# Altium schematic sheet FPGA_165A_Watchdog.SchDoc: LiveDesign Evaluation - Watchdog
size B; Organization: Altium Limited; Address1: L3, 12a Rodborough Rd; Address2: Frenchs Forest; Address3: NSW; Address4: Australia 2086; DocumentNumber: 1; SheetNumber: 1; SheetTotal: 1
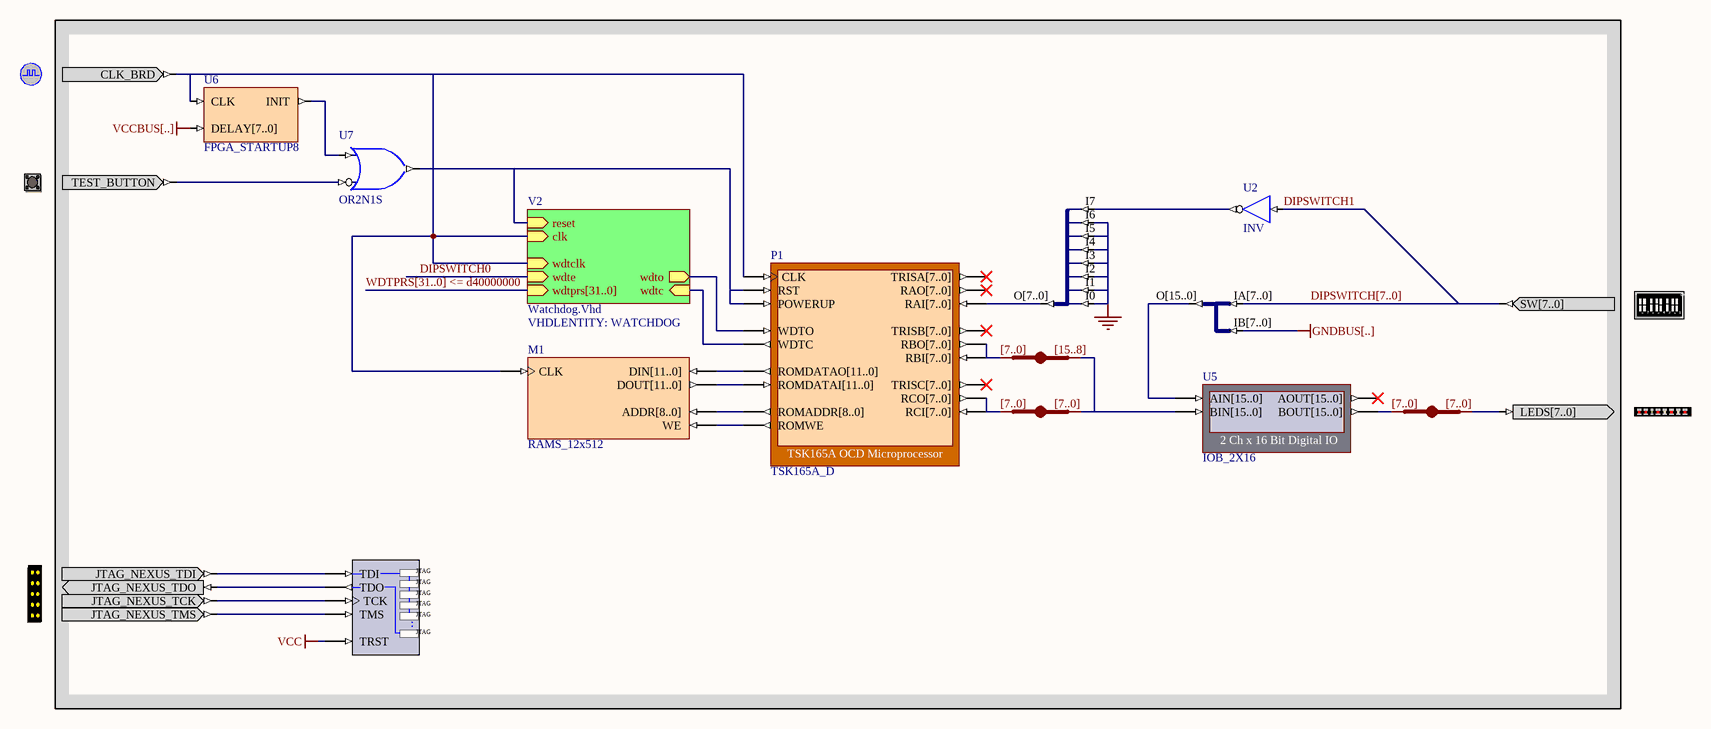
[diagram p0: FPGA_165A_Watchdog.SchDoc]

## Parts
CLOCK_BOARD  CLOCK_BOARD  (value not drawn)
DIPSWITCH  DIPSWITCH  (value not drawn)
JB_AUTO1  IndexA: [7..0]  IndexB: [15..8]  (hidden comment: JB)
JB_AUTO2  IndexA: [7..0]  (hidden comment: JB)
JB_AUTO3  IndexA: [7..0]  (hidden comment: JB)
LED  LED  (value not drawn)
M1  RAMS_12x512
NEXUS_JTAG_CONNECTOR  NEXUS_JTAG_CONNECTOR  (value not drawn)
NEXUS_JTAG_PORT  NEXUS_JTAG_PORT  (value not drawn)
P1  TSK165A_D
TEST_BUTTON  TEST_BUTTON  (value not drawn)
U2  INV
U3  J8S_8B  (value not drawn)
U4  J8B2_16B  (value not drawn)
U5  IOB_2X16
U6  FPGA_STARTUP8
U7  OR2N1S

## Sub-sheets
V2 = Watchdog.Vhd: clk (in), reset (in), wdtc (in), wdtclk (in), wdte (in), wdto (out), wdtprs[31..0] (in)  | VHDLENTITY: WATCHDOG

## Nets
GND: U3.I0 U3.I1 U3.I2 U3.I3 U3.I4 U3.I5 U3.I6
GNDBUS[..]: U4.IB[7..0]
VCC: NEXUS_JTAG_PORT.TRST
VCCBUS[..]: U6.DELAY[7..0]
DIPSWITCH0: sheet V2/wdte
DIPSWITCH1: U2.I
DIPSWITCH[7..0]: DIPSWITCH.SW[7..0] U4.IA[7..0]
NetCLOCK_BOARD_CLK_BRD: CLOCK_BOARD.CLK_BRD M1.CLK P1.CLK U6.CLK ; sheet V2/clk, sheet V2/wdtclk
NetJB_AUTO1_A[0..0]: JB_AUTO1.A[0..0] P1.RBI[7..0] P1.RBO[7..0]
NetJB_AUTO1_B[0..0]: JB_AUTO1.B[0..0] JB_AUTO3.B[0..0] U5.BIN[15..0]
NetJB_AUTO2_A[0..0]: JB_AUTO2.A[0..0] U5.BOUT[15..0]
NetJB_AUTO2_B[0..0]: JB_AUTO2.B[0..0] LED.LEDS[7..0]
NetJB_AUTO3_A[0..0]: JB_AUTO3.A[0..0] P1.RCI[7..0] P1.RCO[7..0]
NetM1_ADDR[8..0]: M1.ADDR[8..0] P1.ROMADDR[8..0]
NetM1_DIN[11..0]: M1.DIN[11..0] P1.ROMDATAO[11..0]
NetM1_DOUT[11..0]: M1.DOUT[11..0] P1.ROMDATAI[11..0]
NetM1_WE: M1.WE P1.ROMWE
NetNEXUS_JTAG_CONNECTOR_JTAG_NEXUS_TCK: NEXUS_JTAG_CONNECTOR.JTAG_NEXUS_TCK NEXUS_JTAG_PORT.TCK
NetNEXUS_JTAG_CONNECTOR_JTAG_NEXUS_TDI: NEXUS_JTAG_CONNECTOR.JTAG_NEXUS_TDI NEXUS_JTAG_PORT.TDI
NetNEXUS_JTAG_CONNECTOR_JTAG_NEXUS_TDO: NEXUS_JTAG_CONNECTOR.JTAG_NEXUS_TDO NEXUS_JTAG_PORT.TDO
NetNEXUS_JTAG_CONNECTOR_JTAG_NEXUS_TMS: NEXUS_JTAG_CONNECTOR.JTAG_NEXUS_TMS NEXUS_JTAG_PORT.TMS
NetP1_POWERUP: P1.POWERUP P1.RST U7.O ; sheet V2/reset
NetP1_RAI[7..0]: P1.RAI[7..0] U3.O[7..0]
NetP1_WDTC: P1.WDTC ; sheet V2/wdtc
NetP1_WDTO: P1.WDTO ; sheet V2/wdto
NetTEST_BUTTON_TEST_BUTTON: TEST_BUTTON.TEST_BUTTON U7.I0
NetU2_O: U2.O U3.I7
NetU4_O[15..0]: U4.O[15..0] U5.AIN[15..0]
NetU6_INIT: U6.INIT U7.I1

Not connected (* = marked no-connect by the designer): P1 RAO[7..0]* TRISA[7..0]* TRISB[7..0]* TRISC[7..0]*; U5 AOUT[15..0]*

## Buses and harness runs
bus DIPSWITCH[7..0]
bus WDTPRS[31..0] <= d40000000 = sheet V2/wdtprs[31..0]

## Notes on the sheet
- Title
- Size:
- Date:
- B
- Number:
- Time:
- Revision:
- Sheet
- of
- File:
- (in symbol DIPSWITCH) ON; 8; 7; 6; 5; 4; 3; 2; 1
- (in symbol NEXUS_JTAG_PORT) JTAG; .

## Library data of the parts
CLOCK_BOARD = CLOCK_BOARD: Global System Clock Supply; PortComponent: True; Published: 19-Nov-2003; Publisher: Altium Limited
DIPSWITCH = DIPSWITCH: 8-Way Dip Switch; PortComponent: True; Published: 19-Nov-2003; Publisher: Altium Limited
JB_AUTO1-JB_AUTO3 = JB: System BUS Joiner; ArchiveName: GENERIC; Published: 18-Dec-2003; Publisher: Altium Limited; Core Revision: 1.00.00
  JB_AUTO2 JB_AUTO3: IndexB: [7..0]
LED = LED: 8-Way LEDS; PortComponent: True; Published: 19-Nov-2003; Publisher: Altium Limited
M1 = RAMS_12x512: Single Port Random Access Memory; Memory_Depth: 512; Memory_Type: RAM_SinglePortBlock; Memory_Width: 12; Memory_ClockEdge: Rising; Nexus_Core: Memory_Program; Published: 13/01/2004; Publisher: Altium Hobart Technology Center
NEXUS_JTAG_CONNECTOR = NEXUS_JTAG_CONNECTOR: JTAG Port; PortComponent: True; Published: 19-Nov-2003; Publisher: Altium Limited
NEXUS_JTAG_PORT = NEXUS_JTAG_PORT: Soft Nexus-Chain Connector; NEXUS_JTAG_CONNECTOR: True; Published: 18-Dec-2003; Publisher: Altium Limited
P1 = TSK165A_D: TSK165A OCD Microprocessor; NEXUS_CORE: Processor_OCDS; NEXUS_JTAG_DEVICE: True; NEXUS_JTAG_ORDER: 0; ChildModel1: TSK165A_D_RAM32X8; ChildCore1: M1; Published: 1/12/2003; Publisher: Altium Hobart Technology Centre; Core Revision: 1.00.00
TEST_BUTTON = TEST_BUTTON: Test Button; PortComponent: True; Published: 19-Nov-2003; Publisher: Altium Limited
U2 = INV: Inverter; ArchiveName: GENERIC; Published: 18-Nov-2003; Publisher: Altium Limited; Xilinx Equivalent: INV; Core Revision: 1.00.00
U3 = J8S_8B: 8 Single pin inputs to single 8-Bit output bus; ArchiveName: GENERIC; Published: 18-Dec-2003; Publisher: Altium Limited; Core Revision: 1.00.00
U4 = J8B2_16B: 2 x 8-Bit input bus to 1 x 16-bit output bus; ArchiveName: GENERIC; Published: 18-Dec-2003; Publisher: Altium Limited; Core Revision: 1.00.00
U5 = IOB_2X16: 2 Ch x 16 Bit Digital IO; NEXUS_CORE: Instrument; NEXUS_JTAG_DEVICE: True; NEXUS_JTAG_ORDER: 0; Published: 30/09/2003; Publisher: Altium Hobart Technology Centre; Core Revision: 1.00.00
U6 = FPGA_STARTUP8: FPGA Startup With 8 Bit Delay; Published: 21/01/2004; Publisher: Altium Hobart Technology Centre; Core Revision: 1.00.00
U7 = OR2N1S: 2-Input OR Gate with Active Low A Input, Single Pin Version; Xilinx Equivalent: OR2B1; ArchiveName: GENERIC; Published: 18-Dec-2003; Publisher: Altium Limited; Core Revision: 1.00.00